# Altium schematic sheet care.SchDoc
size A4
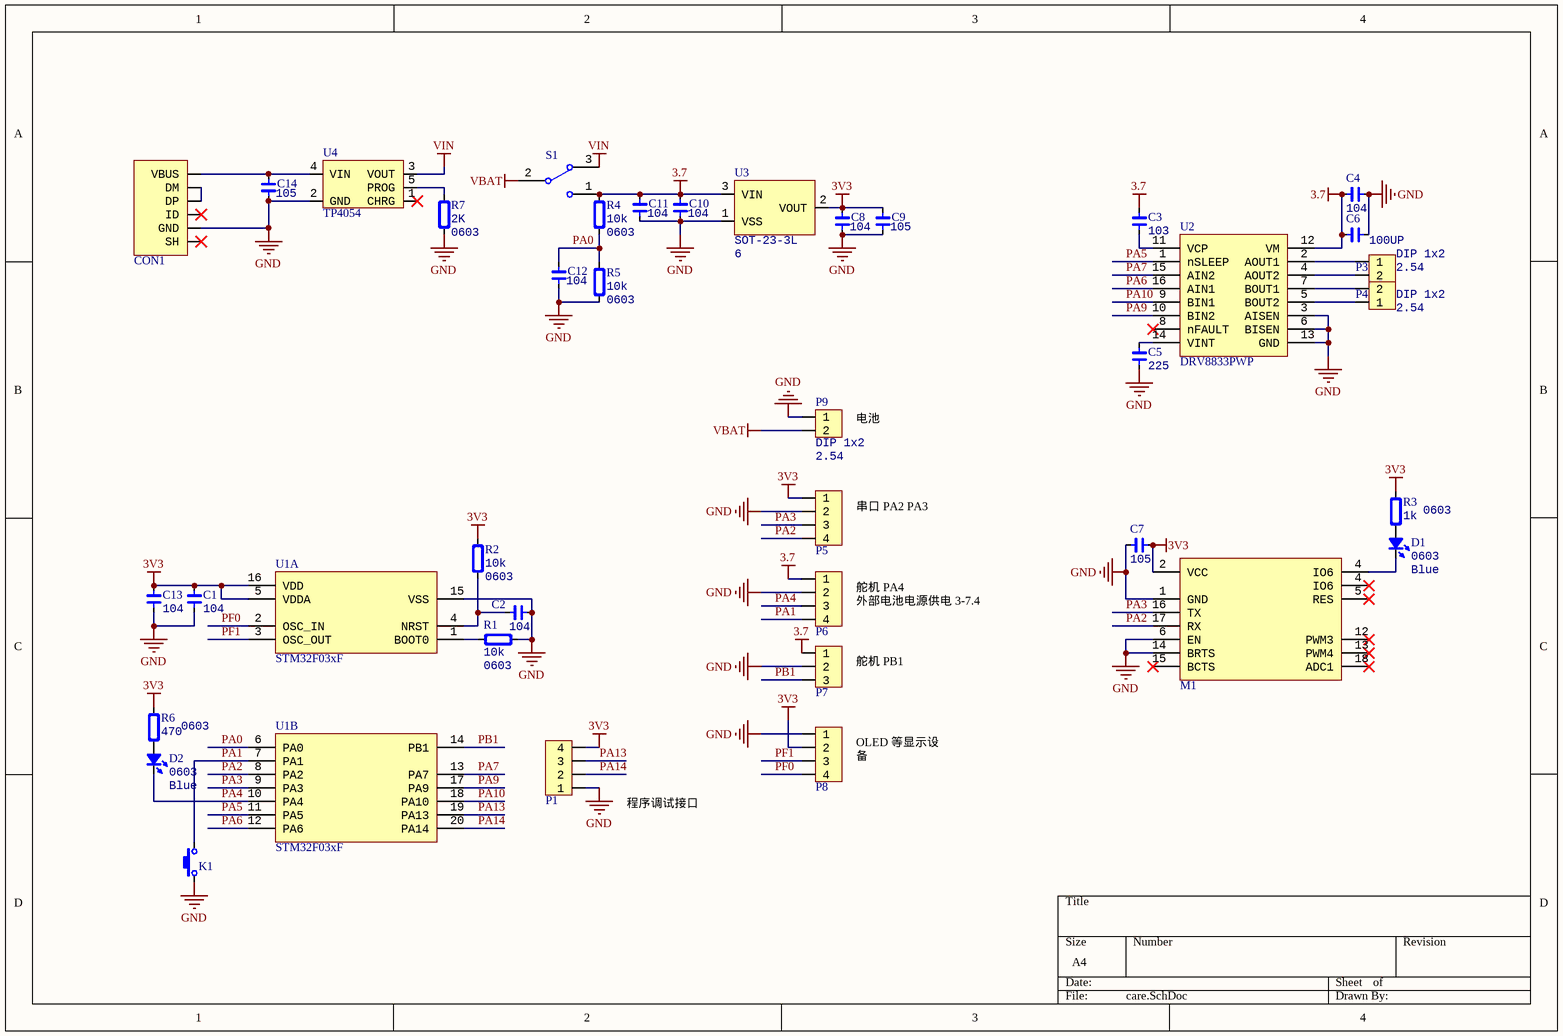
[diagram p0: care.SchDoc]

## Parts
C1  104  [CAP_0603]
C2  104  [CAP_0603]
C3  103  [CAP_0603]
C4  104  [CAP_0603]
C5  225  [CAP_0603]
C6  100UP  [CAP_TAN_B1210]
C7  105  [CAP_0603]
C8  104  [CAP_0603]
C9  105  [CAP_0603]
C10  104  [CAP_0603]
C11  104  [CAP_0603]
C12  104  [CAP_0603]
C13  104  [CAP_0603]
C14  105  [CAP_0603]
CON1  MicroUSB  [USB_Micro-AB]  (value not drawn)
D1  Type: 0603  [LED_0603_RED]  (hidden comment: Blue)
D2  Type: 0603  [LED_0603_RED]  (hidden comment: Blue)
K1  ButtonTACT  [ButtonTACT_3x4x2_180H]  (value not drawn)
M1  RF-BM-S02  [RF-BM-S02]  (value not drawn)
P1  HDR1x4_1.27  [HDR1X4_2.54_180]  (value not drawn)
P3  value 2.54  [HDR1X2_2.54_180]  (hidden comment: DIP 1x2)
P4  value 2.54  [HDR1X2_2.54_180]  (hidden comment: DIP 1x2)
P5  HDR1x4_2.54  [HDR1x4_2.54_180]  (value not drawn)
P6  HDR1x4_2.54  [HDR1x4_2.54_180]  (value not drawn)
P7  HDR1x3_2.54  [HDR1X3_2.54_180]  (value not drawn)
P8  HDR1x4_2.54  [HDR1x4_2.54_180]  (value not drawn)
P9  value 2.54  [HDR1X2_2.54_180]  (hidden comment: DIP 1x2)
R1  Type: 0603  [RES_0603]  (hidden comment: 10k)
R2  Type: 0603  [RES_0603]  (hidden comment: 10k)
R3  Type: 0603  [RES_0603]  (hidden comment: 1k)
R4  Type: 0603  [RES_0603]  (hidden comment: 10k)
R5  Type: 0603  [RES_0603]  (hidden comment: 10k)
R6  Type: 0603  [RES_0603]  (hidden comment: 470)
R7  Type: 0603  [RES_0603]  (hidden comment: 2K)
S1  SPDT 3P  [SwitchSPDT_2.8X6.6_90]  (value not drawn)
U1  STM32F03xF  [TSSOP_E170_P0.65_20]  (parts A,B of 2)
U2  DRV8833PWP  [TSSOP_E170_P0.65_16]
U3  6  [SOT23-3]
U4  TP4054  [SOT23-5]

## Nets
3.7: C3.1 C4.1 C6.1 C10.2 C11.2 P6.1 P7.1 R4.1 S1.1 U2.12(VM) U3.3(VIN)
3V3: C1.1 C7.1 C8.2 C9.2 C13.1 M1.2(VCC) P1.4 P5.1 P8.2 R2.1 R3.1 R6.1 U1.5(VDDA) U1.16(VDD) U3.2(VOUT)
GND: C1.2 C2.2 C4.2 C5.2 C6.2 C7.2 C8.1 C9.1 C10.1 C11.1 C12.1 C13.2 C14.1 CON1.5(GND) K1.1 M1.1(GND) M1.6(EN) M1.14(BRTS) P1.1 P5.2 P6.2 P7.2 P8.1 P9.1 R1.2 R5.2 R7.2 U1.15(VSS) U2.3(AISEN) U2.6(BISEN) U2.13(GND) U3.1(VSS) U4.2(GND)
VBAT: P9.2 S1.2
VIN: S1.3 U4.3(VOUT)
PA0: C12.2 R4.2 R5.1 U1.6(PA0)
PA1: K1.2 P6.4 U1.7(PA1)
PA2: M1.17(RX) P5.4 U1.8(PA2)
PA3: M1.16(TX) P5.3 U1.9(PA3)
PA4: D2.2(K) P6.3 U1.10(PA4)
PA5: U1.11(PA5) U2.1(nSLEEP)
PA6: U1.12(PA6) U2.16(AIN1)
PA7: U1.13(PA7) U2.15(AIN2)
PA9: U1.17(PA9) U2.10(BIN2)
PA10: U1.18(PA10) U2.9(BIN1)
PA13: P1.3 U1.19(PA13)
PA14: P1.2 U1.20(PA14)
PB1: P7.3 U1.14(PB1)
PF0: P8.4 U1.2(OSC_IN)
PF1: P8.3 U1.3(OSC_OUT)
NetC2_1: C2.1 R2.2 U1.4(NRST)
NetC3_2: C3.2 U2.11(VCP)
NetC5_1: C5.1 U2.14(VINT)
NetC14_2: C14.2 CON1.1(VBUS) U4.4(VIN)
NetCON1_2: CON1.2(DM) CON1.3(DP)
NetD1_1: D1.1(A) R3.2
NetD1_2: D1.2(K) M1.4(IO6)
NetD2_1: D2.1(A) R6.2
NetP3_1: P3.1 U2.2(AOUT1)
NetP3_2: P3.2 U2.4(AOUT2)
NetP4_1: P4.1 U2.5(BOUT2)
NetP4_2: P4.2 U2.7(BOUT1)
NetR1_1: R1.1 U1.1(BOOT0)
NetR7_1: R7.1 U4.5(PROG)

Not connected (* = marked no-connect by the designer): CON1 0(SH)* 4(ID)*; M1 5(RES)* 12(PWM3)* 13(PWM4)* 15(BCTS)* 18(ADC1)*; U2 8(nFAULT)*; U4 1(CHRG)*

## Notes on the sheet
- (near P9) 电池
- (near P5) 串口 PA2 PA3
- 舵机 PA4
  外部电池电源供电 3-7.4
- 舵机 PB1
- (near P8) OLED 等显示设备
- 程序调试接口

## Library data of the parts
C1-C5 C7-C14 = Cap_0603: Capacitor; Type: 0603
  C1 C2 C4 C8 C10-C13: Value: 104
  C3: Value: 103
  C5: Value: 225
  C7 C9 C14: Value: 105
C6 = Cap_0603: Capacitor; Value: 100UF; Type: 0603
CON1 = USB_Micro: USB
D1 D2 = LED_0603: LED; Value: Blue
K1 = ButtonTACT_3x4x2_180: Button; Value: ButtonTACT
M1 = RF-BM-S02: Module
P1 = HDR1x4_1.27: Header
P3 P4 P9 = HDR1x2_2.54: Header; Type: DIP 1x2
P5 P6 P8 = HDR1x4_2.54: Header
P7 = HDR1x3_2.54: Header
R1-R7 = Res_0603: Resistor
  R1 R2 R4 R5: Value: 10k
  R3: Value: 1k
  R6: Value: 470
  R7: Value: 2K
S1 = SwitchSPDT_2.8x6.6_90: Switch; Value: SPDT 3P; Type: SPDT
U1 = STM32F03xF: MCU
U2 = DRV8833PWP: Touch
U3 = ME6206A33M3G: SOT-23-3L; Type: SOT-23-3L; Value: 6
U4 = TP4054: Power; Type: SOT223-3